# EAGLE design motor_driver (EAGLE 9.6.2)
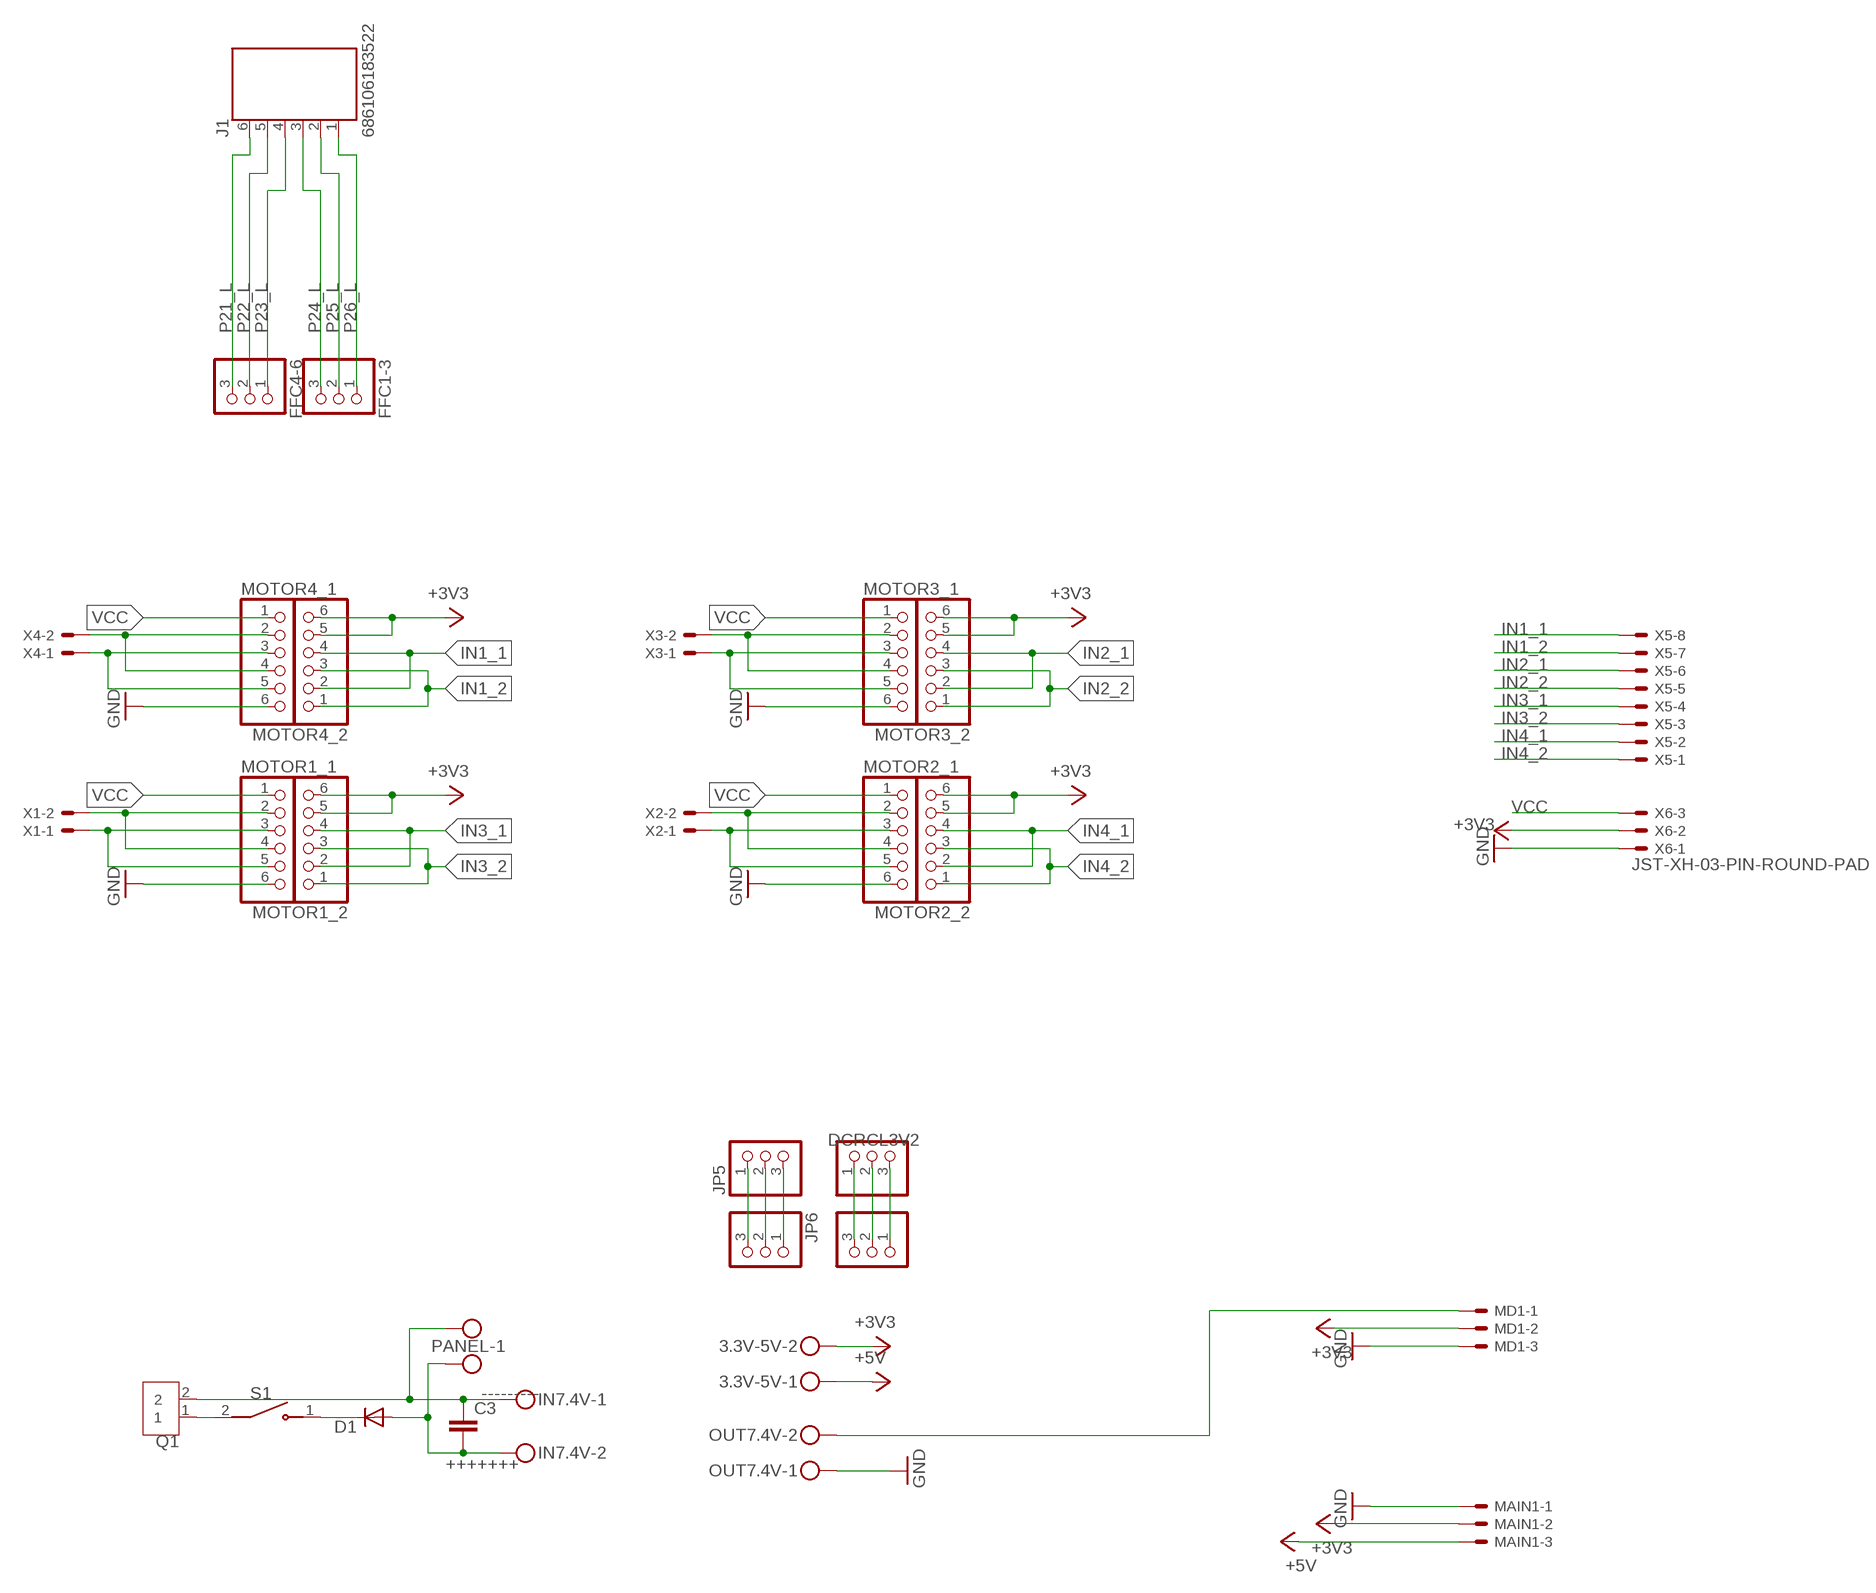
[diagram p0: schematic, sheet 1]

## Parts
3.3V-5V  MKDSN1,5/2-5,08  [MKDSN1,5/2-5,08]
C3  C-EU025-030X050  [C025-030X050]
D1  DIODE-SMC  [SMC]
DCRC3V1  PINHD-1X3  [1X03]
DCRCL3V2  PINHD-1X3  [1X03]
FFC1-3  PINHD-1X03_2.54-S  [1X03-S]
FFC4-6  PINHD-1X03_2.54-S  [1X03-S]
IN7.4V  MKDSN1,5/2-5,08  [MKDSN1,5/2-5,08]
J1  686106183522  [686106183522]
JP5  PINHD-1X03_2.54-S  [1X03-S]
JP6  PINHD-1X03_2.54-S  [1X03-S]
MAIN1  JST-XH-03-PIN-ROUND-PAD  [JST-XH-03-PACKAGE-ROUND-PAD]
MD1  JST-XH-03-PIN-ROUND-PAD  [JST-XH-03-PACKAGE-ROUND-PAD]
MOTOR1_1  PINHD-1X06_2.54-S  [1X06-S]
MOTOR1_2  PINHD-1X06_2.54-S  [1X06-S]
MOTOR2_1  PINHD-1X06_2.54-S  [1X06-S]
MOTOR2_2  PINHD-1X06_2.54-S  [1X06-S]
MOTOR3_1  PINHD-1X06_2.54-S  [1X06-S]
MOTOR3_2  PINHD-1X06_2.54-S  [1X06-S]
MOTOR4_1  PINHD-1X06_2.54-S  [1X06-S]
MOTOR4_2  PINHD-1X06_2.54-S  [1X06-S]
OUT7.4V  MKDSN1,5/2-5,08  [MKDSN1,5/2-5,08]
PANEL  MKDSN1,5/2-5,08  [MKDSN1,5/2-5,08]
Q1  XT60_YELLOW  [AMASS_XT60PB-M]
S1  RR511D1121  [E-SWITCH_RR511D1121]
X1  JST-XH-02-PIN-ROUND-PAD  [JST-XH-02-PACKAGE-ROUND-PAD]
X2  JST-XH-02-PIN-ROUND-PAD  [JST-XH-02-PACKAGE-ROUND-PAD]
X3  JST-XH-02-PIN-ROUND-PAD  [JST-XH-02-PACKAGE-ROUND-PAD]
X4  JST-XH-02-PIN-ROUND-PAD  [JST-XH-02-PACKAGE-ROUND-PAD]
X5  JST-XH-08-PIN-ROUND-PAD  [JST-XH-08-PACKAGE-ROUND-PAD]
X6  JST-XH-03-PIN-ROUND-PAD  [JST-XH-03-PACKAGE-ROUND-PAD]

## Nets
+3V3: 3.3V-5V.2 MAIN1.2 MD1.2 MOTOR1_2.5 MOTOR1_2.6 MOTOR2_2.5 MOTOR2_2.6 MOTOR3_2.5 MOTOR3_2.6 MOTOR4_2.5 MOTOR4_2.6 X6.2
+5V: 3.3V-5V.1 MAIN1.3
+++++++: C3.2 D1.A IN7.4V.2 PANEL.2
---------: C3.1 IN7.4V.1 PANEL.1 Q1.2
GND: MAIN1.1 MD1.3 MOTOR1_1.6 MOTOR2_1.6 MOTOR3_1.6 MOTOR4_1.6 OUT7.4V.1 X6.1
IN1_1: MOTOR4_2.2 MOTOR4_2.4 X5.8
IN1_2: MOTOR4_2.1 MOTOR4_2.3 X5.7
IN2_1: MOTOR3_2.2 MOTOR3_2.4 X5.6
IN2_2: MOTOR3_2.1 MOTOR3_2.3 X5.5
IN3_1: MOTOR1_2.2 MOTOR1_2.4 X5.4
IN3_2: MOTOR1_2.1 MOTOR1_2.3 X5.3
IN4_1: MOTOR2_2.2 MOTOR2_2.4 X5.2
IN4_2: MOTOR2_2.1 MOTOR2_2.3 X5.1
N$2: MOTOR1_1.2 MOTOR1_1.4 X1.2
N$3: MOTOR1_1.3 MOTOR1_1.5 X1.1
N$4: MOTOR2_1.2 MOTOR2_1.4 X2.2
N$5: MOTOR2_1.3 MOTOR2_1.5 X2.1
N$6: Q1.1 S1.2(COM)
N$7: DCRC3V1.3 DCRCL3V2.1
N$9: JP5.1 JP6.3
N$10: MOTOR3_1.2 MOTOR3_1.4 X3.2
N$11: MOTOR3_1.3 MOTOR3_1.5 X3.1
N$12: JP5.2 JP6.2
N$13: MOTOR4_1.2 MOTOR4_1.4 X4.2
N$14: MOTOR4_1.3 MOTOR4_1.5 X4.1
N$15: DCRC3V1.2 DCRCL3V2.2
N$16: DCRC3V1.1 DCRCL3V2.3
N$17: JP5.3 JP6.1
N$18: MD1.1 OUT7.4V.2
N$19: D1.C S1.1(NO)
P21_L: FFC4-6.3 J1.6
P22_L: FFC4-6.2 J1.5
P23_L: FFC4-6.1 J1.4
P24_L: FFC1-3.3 J1.3
P25_L: FFC1-3.2 J1.2
P26_L: FFC1-3.1 J1.1
VCC: MOTOR1_1.1 MOTOR2_1.1 MOTOR3_1.1 MOTOR4_1.1 X6.3

## Library data of the parts
3.3V-5V IN7.4V OUT7.4V PANEL = con-phoenix-508:MKDSN1,5/2-5,08: MKDSN 1,5/ 2-5,08 Printklemme Nennstrom: 13,5 A Nennspannung: 250 V Rastermaß: 5,08 mm Polzahl: 2 Anschlussart: Schraubanschluss Montage: Löten Anschlussrichtung Leiter/Platine: 0 ° Artikelnummer: 1729128 Source: http://eshop.phoenixcontact.com .. 1729128.pdf
C3 = rcl:C-EU: CAPACITOR, European symbol; SPICEPREFIX: C
D1 = diode:DIODE-: DIODE
DCRC3V1 DCRCL3V2 = adafruit:PINHD-1X3: PIN HEADER
FFC1-3 FFC4-6 JP5 JP6 = pinhead-2:PINHD-1X03: PIN HEADER
J1 = 686106183522:686106183522: 686106183522 WR-FPC 1.00mm SMT Horizontal Bottom Contact - Low Profile <http://katalog.we-online.de/media/images/v2/Family_WR-FPC_6861xx183522.jpg> Details see: http://katalog.we-online.de/en/em/FPC_1_00_SMT_ZIF_HORIZONTAL_BOTTOM_CONTACT_LOW_PROFILE_6861xx183522 Created by Yingchun,shan 2016 (C) Wurth Elektronik Check availability <https://pricing.snapeda.com/parts/686106183522/Wurth%20Electronics/view-part?ref=eda>; AVAILABILITY: In Stock; DESCRIPTION: 6 Position FFC Connector Contacts, Bottom 0.039 (1.00mm) Surface Mount, Right Angle; MF: Wurth Electronics; MP: 686106183522; PACKAGE: None; PRICE: None; PURCHASE-URL: https://pricing.snapeda.com/search/part/686106183522/?ref=eda
MAIN1 MD1 X6 = Rembrandt Electronics - JST XH Connectors v1-0:JST-XH-03-PIN: JST XH Connector 2 Pin Wire to board connector. Pitch: 2,54 mm, (0.100") Number of pins: 3 Created by Rembrandt Electronics www.rembrandtelectronics.com
MOTOR1_1 MOTOR1_2 MOTOR2_1 MOTOR2_2 MOTOR3_1 MOTOR3_2 MOTOR4_1 MOTOR4_2 = pinhead-2:PINHD-1X06: PIN HEADER
Q1 = XT60_YELLOW:XT60_YELLOW: Connector 2 pins Check availability <https://pricing.snapeda.com/parts/XT60%20YELLOW/Pololu/view-part?ref=eda>; AVAILABILITY: Not in stock; DESCRIPTION: Power connector; 65A; PIN: 2; Colour: yellow; MF: Pololu; MP: XT60 YELLOW; PACKAGE: None; PRICE: None
S1 = RR511D1121:RR511D1121: Check availability <https://pricing.snapeda.com/parts/RR511D1121/E-Switch/view-part?ref=eda>; AVAILABILITY: In Stock; DESCRIPTION: Rocker Switch, RR5 Series, SPST,OFF-ON,Blk Rocker,I/O Legend, 20A, 125VAC, QC; MF: E-Switch; MP: RR511D1121; PACKAGE: None; PRICE: None; PURCHASE-URL: https://pricing.snapeda.com/search/part/RR511D1121/?ref=eda
X1-X4 = Rembrandt Electronics - JST XH Connectors v1-0:JST-XH-02-PIN: JST XH Connector 2 Pin Wire to board connector. Pitch: 2,54 mm, (0.100") Number of pins: 2 Created by Rembrandt Electronics www.rembrandtelectronics.com
X5 = Rembrandt Electronics - JST XH Connectors v1-0:JST-XH-08-PIN: JST XH Connector 2 Pin Wire to board connector. Pitch: 2,54 mm, (0.100") Number of pins: 8 Created by Rembrandt Electronics www.rembrandtelectronics.com

## Net classes
0 default: width 0.5 mm, clearance 0.3 mm

## Board
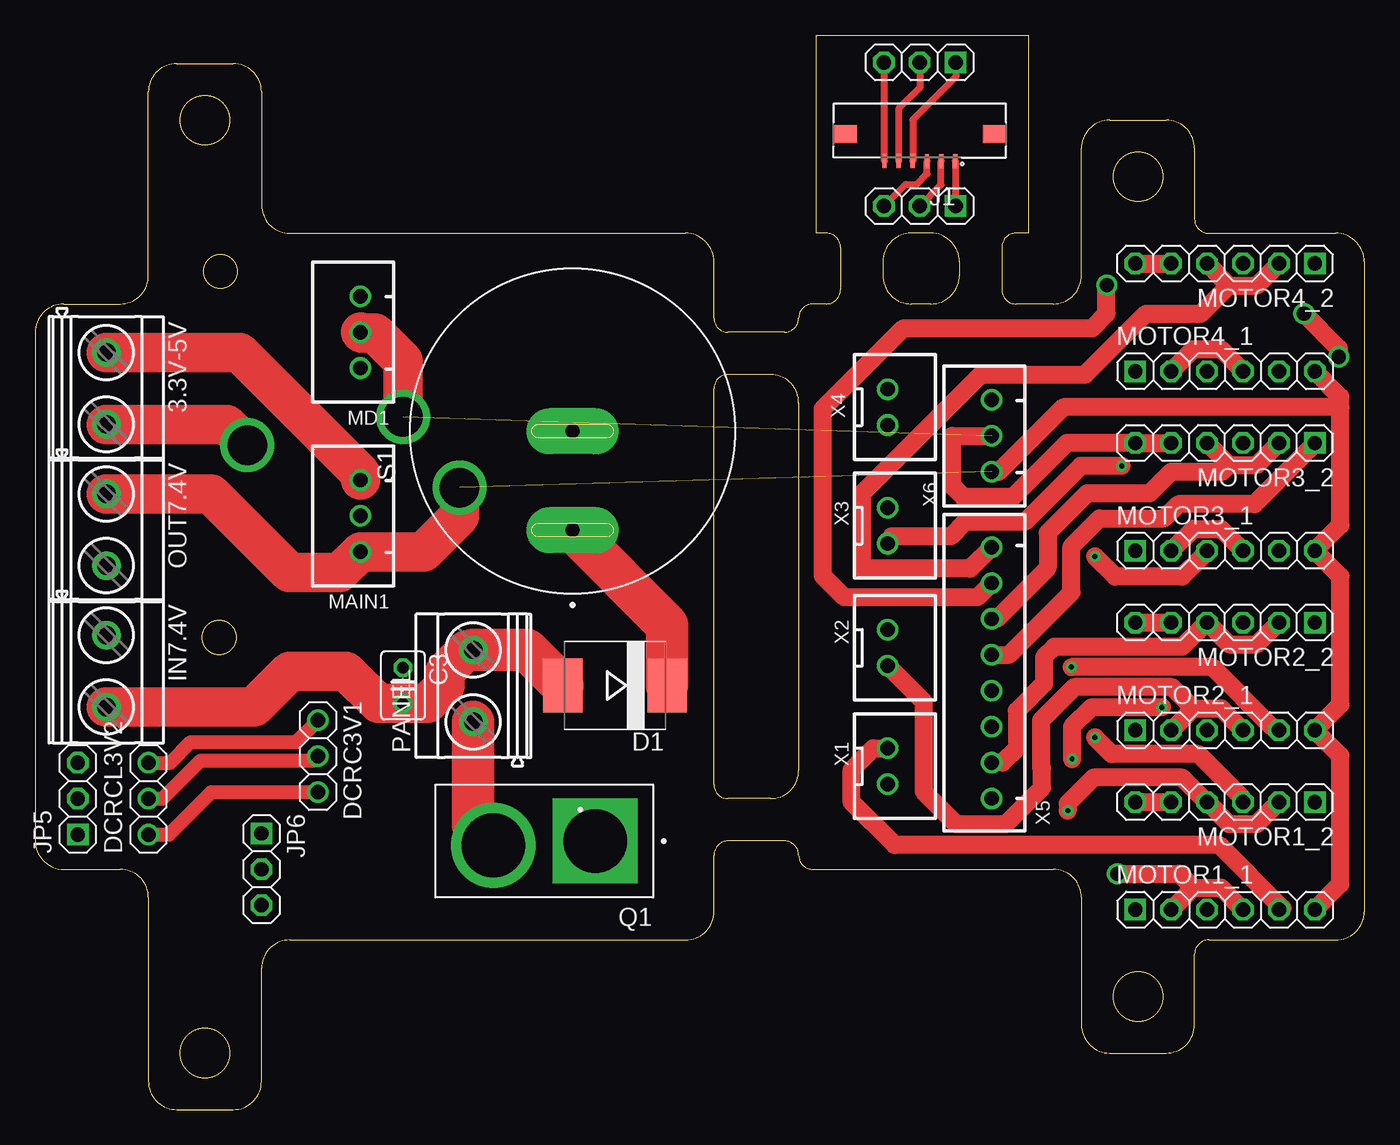
[diagram p1: board, top side]
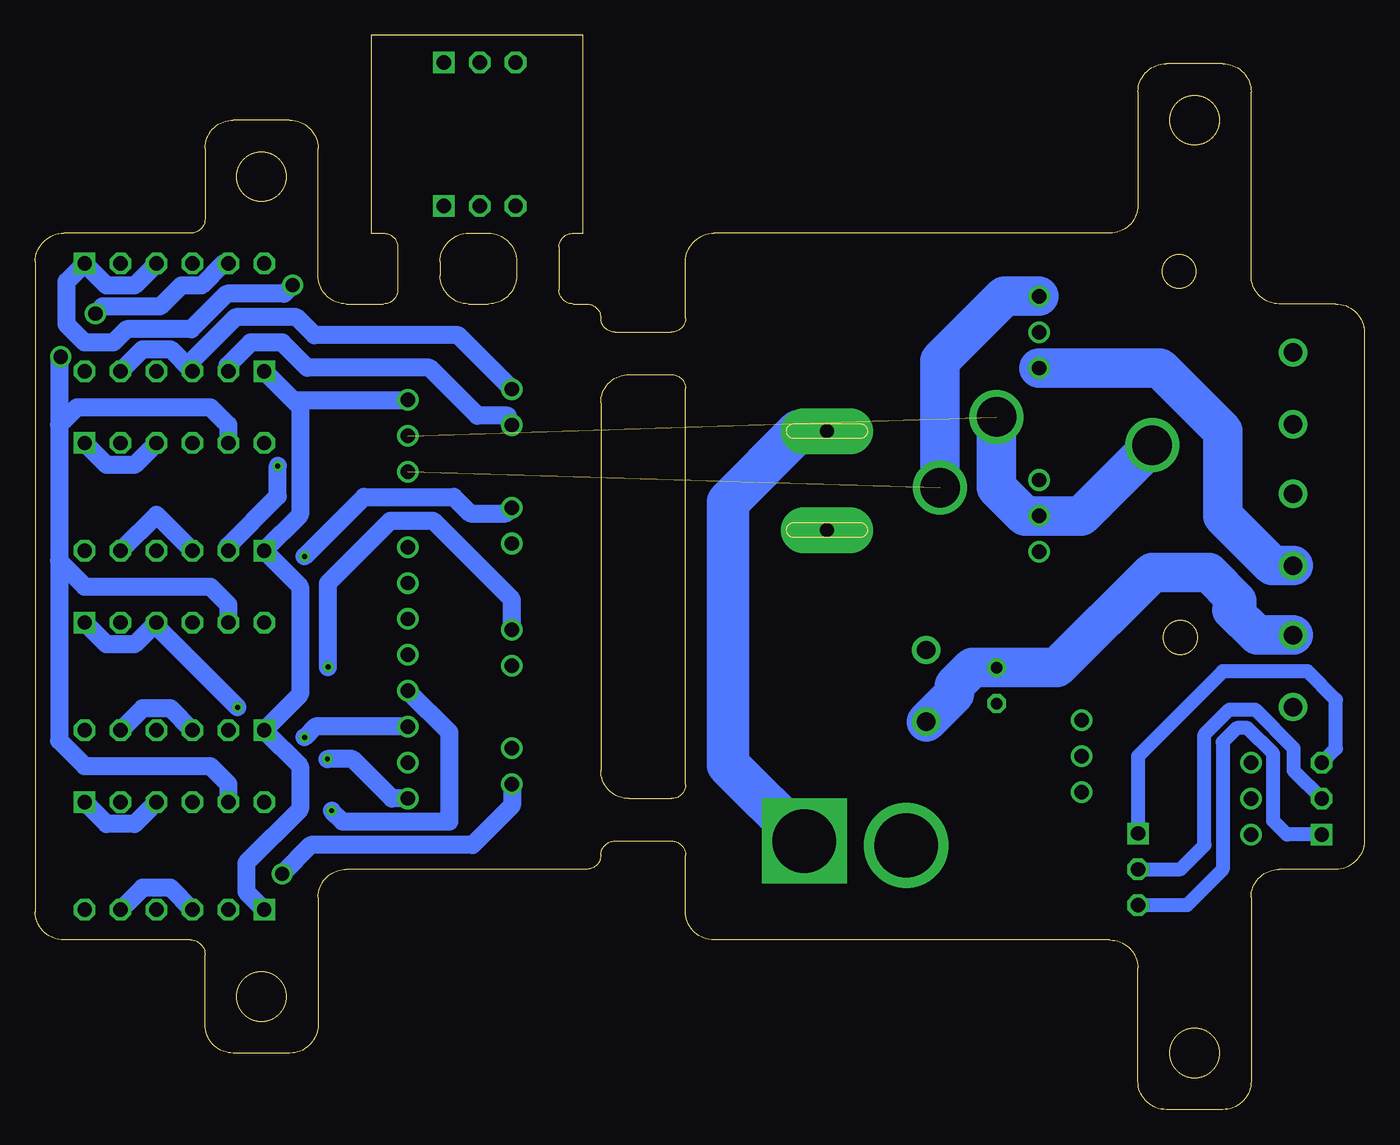
[diagram p2: board, bottom side, seen from below]

Size 94 x 76 mm. Coordinates in mm from the lower left corner, seen from the top.
Outline: 52,22 arc90 54,24
Outline: 52,22 arc90 54,24
Outline: 52,22 49,22 arc-90 48,23 48,51 arc-90 49,52 52,52 arc-90 54,50 54,24
Outline: 83,62 92,62 arc-90 94,60 94,14 arc-90 92,12 83,12 arc90 82,11 82,6 arc-90 80,4 76,4 arc-90 74,6 74,15 arc90 72,17 55,17 arc-90 54,18 arc90 53,19 49,19 arc90 48,18 48,14 arc-90 46,12 18,12 arc90 16,10 16,2 arc-90 14,0 10,0 arc-90 8,2 8,15 arc90 6,17 2,17 arc-90 0,19 0,55 arc-90 2,57 6,57 arc90 8,59 8,72 arc-90 10,74 14,74 arc-90 16,72 16,64 arc90 18,62 46,62 arc-90 48,60 48,56 arc90 49,55 53,55 arc90 54,56 arc-90 55,57 55.95,57 arc90 56.95,58 56.95,61 arc90 55.95,62 55.25,62 55.25,76 70.25,76 70.25,62 69.36,62 arc90 68.36,61 68.36,58 arc90 69.36,57 72,57 arc90 74,59 74,68 arc-90 76,70 80,70 arc-90 82,68 82,63 arc90 83,62
Outline: 65.36,60 arc90 63.36,62 61.95,62 arc90 59.95,60 59.95,59 arc90 61.95,57 63.36,57 arc90 65.36,59 65.36,60
Outline: circle at 13.1,59.3 radius 1.2
Outline: circle at 13,33.4 radius 1.2
Outline: circle at 78,66 radius 1.75
Outline: circle at 12,70 radius 1.75
Outline: circle at 12,4 radius 1.75
Outline: circle at 78,8 radius 1.75
Copper layers (1*16): Top 0.035mm / dielectric 1.5mm / Bottom 0.035mm
Design rules "default": minimum track width 6mil, minimum drill 0.35mm, track to track 6mil, track to pad 6mil, pad to pad 6mil, via to via 6mil, smd to smd 6mil, copper to edge 40mil, drill to drill 6mil, minimum pad ring 10mil, minimum via ring 8mil, stop-mask expansion 4mil, vias tented up to drill 0mil, thermal gap 10mil

### Footprints (pad centres in the part's own frame; a part is rotated, then mirrored left to right if it is on the bottom)
MKDSN1,5/2-5,08 = drill 1.3 pad 2: 1 -2.561,0.025; 2 2.519,0.025
C025-030X050 = drill 0.813 octagon: 1 -1.27,0; 2 1.27,0
SMC = smd 2.8 x 3.8: A 3.7,0; C -3.7,0
1X03 = drill 1.016: 1 -2.54,0; 2 0,0; 3 2.54,0
1X03-S = drill 1.016 square: 1 -2.54,0 | drill 1.016 octagon: 2 0,0; 3 2.54,0
686106183522 = smd 0.3 x 1: 1 -2.5,1.9; 2 -1.5,1.9; 3 -0.5,1.9; 4 0.5,1.9; 5 1.5,1.9; 6 2.5,1.9 | smd 1.65 x 1.3: Z1 -5.275,0; Z2 5.275,0
JST-XH-03-PACKAGE-ROUND-PAD = drill 1.016: 1 -2.54,0; 2 0,0; 3 2.54,0
1X06-S = drill 1.016 square: 1 -6.35,0 | drill 1.016 octagon: 2 -3.81,0; 3 -1.27,0; 4 1.27,0; 5 3.81,0; 6 6.35,0
AMASS_XT60PB-M = drill 4.5 pad 6 square: 1 -3.6,0 | drill 4.5 pad 6: 2 3.6,0.305
E-SWITCH_RR511D1121 = drill 0.98 pad 3.26 long: 1 -7,0; 2 0,0
JST-XH-02-PACKAGE-ROUND-PAD = drill 1.016: 1 -1.27,0; 2 1.27,0
JST-XH-08-PACKAGE-ROUND-PAD = drill 1.016: 1 -8.89,0; 2 -6.35,0; 3 -3.81,0; 4 -1.27,0; 5 1.27,0; 6 3.81,0; 7 6.35,0; 8 8.89,0

### Placement (x,y rotation side)
3.3V-5V  5,51 270 top
C3  26,30 270 top
D1  41,30 180 top
DCRC3V1  20,25 270 top
DCRCL3V2  8,22 90 top
FFC1-3  62.57,63.92 180 top
FFC4-6  62.57,74.08 180 top
IN7.4V  5,31 270 top
J1  62.57,69 180 top
JP5  3,22 90 top
JP6  16,17 270 top
MAIN1  23,42 90 top
MD1  23,55 90 top
MOTOR1_1  84.16,14.14 0 top
MOTOR1_2  84.16,21.76 180 top
MOTOR2_1  84.16,26.84 0 top
MOTOR2_2  84.16,34.46 180 top
MOTOR3_1  84.16,39.54 0 top
MOTOR3_2  84.16,47.16 180 top
MOTOR4_1  84.16,52.24 0 top
MOTOR4_2  84.16,59.86 180 top
OUT7.4V  5,41 270 top
PANEL  31,30 90 top
Q1  36,19 180 top
S1  38,48 90 top
X1  60.28,24.3 270 top
X2  60.28,32.68 270 top
X3  60.28,41.32 270 top
X4  60.28,49.7 270 top
X5  67.65,30.9 90 top
X6  67.65,47.67 90 top

### Tracks (layer width: path | path; a pad name or v marks a point on that pad's centre or on a via)
+3V3  (via drill 1, 2.8)  (1 unrouted)
  Top 1.27: MOTOR4_2.6 MOTOR4_2.5 | MOTOR3_2.5 MOTOR3_2.6 72.98,47.16 69.15,43.33 65.64,43.33 64.86,44.11 64.86,47.67 X6.2 | MOTOR2_2.6 MOTOR2_2.5 | MOTOR1_2.6 MOTOR1_2.5 | v89.75,56.3 92.21,53.84 v92.21,53.26
  Top 2.8: 3.3V-5V.2 13.52,48.48 v15,47 | MD1.2 23.08,54.92 24.02,54.92 26,52.94 v26,49
  Bottom 1.27: 92.32,48.43 91.05,49.7 81.62,49.7 80.35,48.43 MOTOR3_2.5 | 92.32,38.81 90.51,37 81.62,37 80.35,35.73 MOTOR2_2.5 | 92.32,48.43 92.32,38.81 | 92.32,38.81 92.32,26.11 90.51,24.3 81.62,24.3 80.35,23.03 MOTOR1_2.5 | 92.32,48.43 92.32,53.26 v92.21,53.26 | MOTOR4_2.5 80.7,59.86 82.25,58.31 83.68,58.31 85.18,56.81 89.24,56.81 v89.75,56.3
  Bottom 2.8: v15,47 20,42 MAIN1.2 24,42 26,44 v26,49
+5V
  Top 2.8: 3.3V-5V.1 14.44,53.56 23,45 MAIN1.3
+++++++
  Top 2.8: PANEL.2 30.52,32.52 29,31 29,30 27.73,28.73 C3.2 24.27,28.73 22,31 18,31 15.48,28.48 IN7.4V.2
  Top 3: D1.A 34.78,32.52 PANEL.2
---------
  Top 3: Q1.2 30.98,20.12 PANEL.1
  Bottom 2.8: PANEL.1 29,29.41 29,30 27.73,31.27 C3.1 21.73,31.27 15,38 11,38 9,36 9,35.72 9.36,35.36 7.56,33.56 IN7.4V.1
GND  (via drill 2.8)  (1 unrouted)
  Top 1.27: MOTOR1_1.6 92.32,15.95 92.32,25.03 MOTOR2_1.6 92.32,28.65 92.32,37.73 MOTOR3_1.6 92.32,41.35 92.32,49.7 | MOTOR4_1.6 92.32,50.43 92.32,49.7 | X6.1 68.16,45.13 72.73,49.7 92.32,49.7
  Top 2.8: OUT7.4V.1 12.44,43.56 18,38 21.54,38 MAIN1.1 27.46,39.46 30,42 v30,44
  Bottom 2.8: MD1.3 25.46,57.54 30,53 v30,44
IN1_1
  Top 1.27: 84.44,58.31 86.42,58.31 MOTOR4_2.2 | MOTOR4_2.4 84.44,58.31 | X5.8 66.13,38.27 58.51,38.27 58.51,43.6 66.89,51.99 74.25,51.99 78.57,56.3 82.43,56.3 84.44,58.31
IN1_2  (via drill 1)
  Top 1.27: X5.7 66.63,36.24 57.24,36.24 55.71,37.76 55.71,49.59 61.41,55.29 74.76,55.29 75.78,56.3 75.78,58.34 v75.79,58.34
  Bottom 1.27: MOTOR4_2.3 86.98,58.31 88.96,58.31 MOTOR4_2.1 91.78,58.59 91.78,55.54 90.51,54.27 88.48,54.27 87.54,55.21 82.97,55.21 80.45,57.73 76.4,57.73 v75.79,58.34
IN2_1
  Top 1.27: 84.44,45.61 86.42,45.61 MOTOR3_2.2 | MOTOR3_2.4 84.44,45.61 | X5.6 68.01,34.71 71.61,38.32 71.61,40.81 74.41,43.6 78.83,43.6 80.35,45.13 83.96,45.13 84.44,45.61
IN2_2
  Top 1.27: X5.5 68.87,32.17 73.29,36.59 73.29,39.84 75.27,41.83 79.84,41.83 80.86,42.84 86.24,42.84 90.51,47.11 MOTOR3_2.1
  Bottom 1.27: MOTOR3_2.3 86.98,45.61 88.96,45.61 MOTOR3_2.1
IN3_1  (via drill 0.35)
  Top 1.27: MOTOR1_2.2 86.42,20.21 84.44,20.21 MOTOR1_2.4 82.53,22.06 81.11,23.49 74.86,23.49 73.03,21.66 v73.03,21.15
  Bottom 1.27: X5.4 64.7,26.69 64.7,20.39 72.27,20.39 v73.03,21.15
IN3_2  (via drill 0.35)
  Top 1.27: v74.97,26.33 76.13,25.16 82.28,25.16 85.38,22.06 MOTOR1_2.3
  Bottom 1.27: MOTOR1_2.1 88.96,20.21 86.98,20.21 MOTOR1_2.3 | X5.3 74.2,27.09 v74.97,26.33
IN4_1
  Top 1.27: MOTOR2_2.2 86.42,32.91 84.44,32.91 MOTOR2_2.4 82.53,34.16 81.11,32.73 72.07,32.73 71.36,32.02 71.36,30.14 69.43,28.21 69.43,25.57 68.41,24.55 X5.2
IN4_2  (via drill 0.35)
  Top 1.27: v73.34,24.81 73.34,27.09 74.71,28.47 v79.69,28.47
  Bottom 1.27: MOTOR2_2.1 88.96,32.91 86.98,32.91 MOTOR2_2.3 85.38,34.16 v79.69,28.47 | v73.34,24.81 71.56,24.81 68.77,22.01 X5.1
N$2  (via drill 1)
  Top 1.27: 81.9,15.69 83.88,15.69 MOTOR1_1.4 | MOTOR1_1.2 81.9,15.69 | v76.54,16.68 80.91,16.68 81.9,15.69
  Bottom 1.27: X1.2 60.28,21.51 63.08,18.71 74.51,18.71 v76.54,16.68
N$3
  Top 1.27: MOTOR1_1.5 88.22,14.24 83.75,18.71 60.79,18.71 57.74,21.76 57.74,24.05 59.27,25.57 X1.1
  Bottom 1.27: MOTOR1_1.5 86.42,15.69 84.44,15.69 MOTOR1_1.3
N$4
  Top 1.27: 81.9,28.39 83.88,28.39 MOTOR2_1.4 | MOTOR2_1.2 81.9,28.39 | 81.9,28.39 80.4,29.89 73.49,29.89 71.16,27.55 71.16,24.2 71.21,24.15 71.21,22.78 68.64,20.21 65.14,20.21 62.82,22.52 62.82,28.87 X2.2
N$5  (via drill 0.35)
  Top 1.27: v73.29,31.31 83.25,31.31 87.51,27.04 MOTOR2_1.5
  Bottom 1.27: MOTOR2_1.5 86.42,28.39 84.44,28.39 MOTOR2_1.3 | X2.1 60.28,36.09 65.87,41.67 68.87,41.67 73.29,37.25 v73.29,31.31
N$6
  Bottom 3: S1.2 40,48 45,43 45,24.4 Q1.1
N$7
  Top 1: DCRCL3V2.1 9.46,19.46 12.46,22.46 DCRC3V1.3
N$9
  Bottom 1: JP5.1 5.46,19.46 6.44,20.44 6.44,25.19 8.25,27 9,27 10,26 10,17 12.54,14.46 JP6.3
N$10  (via drill 0.35)
  Top 1.27: MOTOR3_1.4 83.88,41.09 81.9,41.09 MOTOR3_1.2 | v76.84,45.53 73.95,45.53 69.99,41.57 65.77,41.57 64.75,40.56 60.59,40.56 X3.2
  Bottom 1.27: v76.84,45.53 76.84,43.4 80.4,39.84 MOTOR3_1.2
N$11  (via drill 0.35)
  Top 1.27: v74.97,39.13 76.39,37.71 81.11,37.71 82.53,39.13 MOTOR3_1.3
  Bottom 1.27: MOTOR3_1.5 85.43,42.08 MOTOR3_1.3 | X3.1 60.69,42.18 63.23,42.18 64.4,43.35 70.75,43.35 v74.97,39.13
N$12
  Bottom 1: JP6.2 13,17 11.3,18.7 11.3,26.54 9.54,28.3 7.71,28.3 5,25.59 5,24 JP5.2
N$13
  Top 1.27: MOTOR4_1.2 81.9,53.79 83.88,53.79 MOTOR4_1.4
  Bottom 1.27: X4.2 60.59,49.09 62.72,49.09 66.13,52.49 74.76,52.49 76.54,54.27 78.78,54.27 80.4,52.65 MOTOR4_1.2
N$14
  Bottom 1.27: MOTOR4_1.5 86.42,53.79 84.44,53.79 MOTOR4_1.3 82.89,53 79.84,56.05 75.52,56.05 74.25,54.78 64.09,54.78 X4.1
N$15
  Top 1: DCRCL3V2.2 9,22 11.7,24.7 19.7,24.7 DCRC3V1.2
N$16
  Top 1: DCRCL3V2.3 9.54,24.54 11,26 18.46,26 DCRC3V1.1
N$17
  Bottom 1: JP5.3 2,25.54 2,29 4,31 10,31 16,25 JP6.1
N$18
  Bottom 2.8: MD1.1 14.46,52.46 10,48 10,42 6.48,38.48 OUT7.4V.2
N$19
  Top 3: D1.C 44.7,34.3 S1.1
P21_L
  Top 0.508: FFC4-6.3 60.03,67.14 J1.6
P22_L
  Top 0.508: FFC4-6.2 62.57,72.31 61.07,70.81 J1.5
P23_L
  Top 0.508: FFC4-6.1 65.11,73.07 62.07,70.03 J1.4
P24_L
  Top 0.508: FFC1-3.3 61.55,65.45 62.32,65.45 63.07,66.2 J1.3
P25_L
  Top 0.508: FFC1-3.2 64.07,65.42 J1.2
P26_L
  Top 0.508: FFC1-3.1 65.11,67.06 J1.1
VCC
  Bottom 1.27: X6.3 75.78,50.21 MOTOR4_1.1 75.27,49.7 75.27,42.08 MOTOR3_1.1 75.27,37 75.27,29.38 MOTOR2_1.1 75.27,24.3 75.27,21.25 79.08,17.44 79.08,15.41 MOTOR1_1.1